# Altium schematic sheet EXT_M_V1.SchDoc
size A4
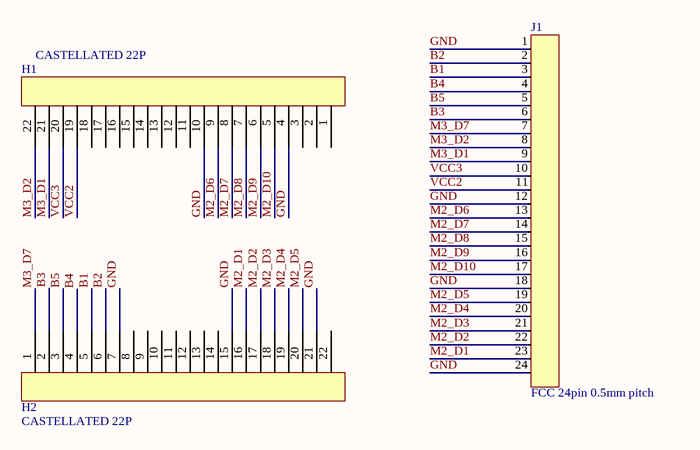
[diagram p0: EXT_M_V1.SchDoc]

## Parts
H1  CASTELLATED 22P  [CASTELLATED 22P]
H2  CASTELLATED 22P  [CASTELLATED 22P]
J1  FCC 24pin 0.5mm pitch  [FCC_24P_0.5MM]

## Nets
B1: H2.5 J1.3
B2: H2.6 J1.2
B3: H2.2 J1.6
B4: H2.4 J1.4
B5: H2.3 J1.5
GND: H1.4 H1.10 H2.7 H2.15 H2.21 J1.1 J1.12 J1.18 J1.24
M2_D1: H2.16 J1.23
M2_D2: H2.17 J1.22
M2_D3: H2.18 J1.21
M2_D4: H2.19 J1.20
M2_D5: H2.20 J1.19
M2_D6: H1.9 J1.13
M2_D7: H1.8 J1.14
M2_D8: H1.7 J1.15
M2_D9: H1.6 J1.16
M2_D10: H1.5 J1.17
M3_D1: H1.21 J1.9
M3_D2: H1.22 J1.8
M3_D7: H2.1 J1.7
VCC2: H1.19 J1.11
VCC3: H1.20 J1.10

Not connected (* = marked no-connect by the designer): H1 1 2 3 11 12 13 14 15 16 17 18; H2 8 9 10 11 12 13 14 22

## Library data of the parts
J1 = FCC_24P_0.5MM